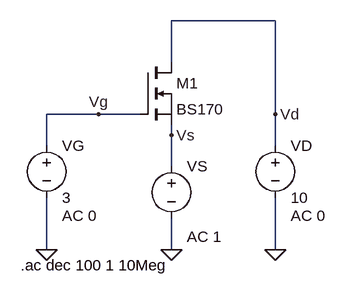
[diagram p0: schematic tarea6.asc]
tarea6.asc, the LTspice schematic file:
Version 4.1
SHEET 1 880 680
WIRE 400 64 240 64
WIRE 240 128 240 64
WIRE 128 208 48 208
WIRE 192 208 128 208
WIRE 400 208 400 64
WIRE 240 240 240 224
WIRE 48 256 48 208
WIRE 400 256 400 208
WIRE 240 288 240 240
WIRE 48 416 48 336
WIRE 240 416 240 368
WIRE 400 416 400 336
FLAG 240 416 0
FLAG 400 416 0
FLAG 48 416 0
FLAG 128 208 Vg
FLAG 240 240 Vs
FLAG 400 208 Vd
SYMBOL nmos 192 128 R0
SYMATTR InstName M1
SYMATTR Value BS170
SYMBOL voltage 48 240 R0
WINDOW 123 24 124 Left 2
WINDOW 39 0 0 Left 0
SYMATTR InstName VG
SYMATTR Value 3
SYMATTR Value2 AC 0
SYMBOL voltage 240 272 R0
WINDOW 123 24 124 Left 2
WINDOW 39 0 0 Left 0
SYMATTR InstName VS
SYMATTR Value ""
SYMATTR Value2 AC 1
SYMBOL voltage 400 240 R0
WINDOW 123 24 124 Left 2
WINDOW 39 0 0 Left 0
SYMATTR InstName VD
SYMATTR Value 10
SYMATTR Value2 AC 0
TEXT 8 440 Left 2 !.ac dec 100 1 10Meg

The netlist it stands for:
* tarea6.asc
M1 Vd Vg Vs Vs BS170
VG Vg 0 3 AC 0
VS Vs 0 AC 1
VD Vd 0 10 AC 0
.model NMOS NMOS
.model PMOS PMOS
.lib standard.mos
.ac dec 100 1 10Meg
.backanno
.end